# EAGLE schematic DriverSchematic (EAGLE 7.5.0)
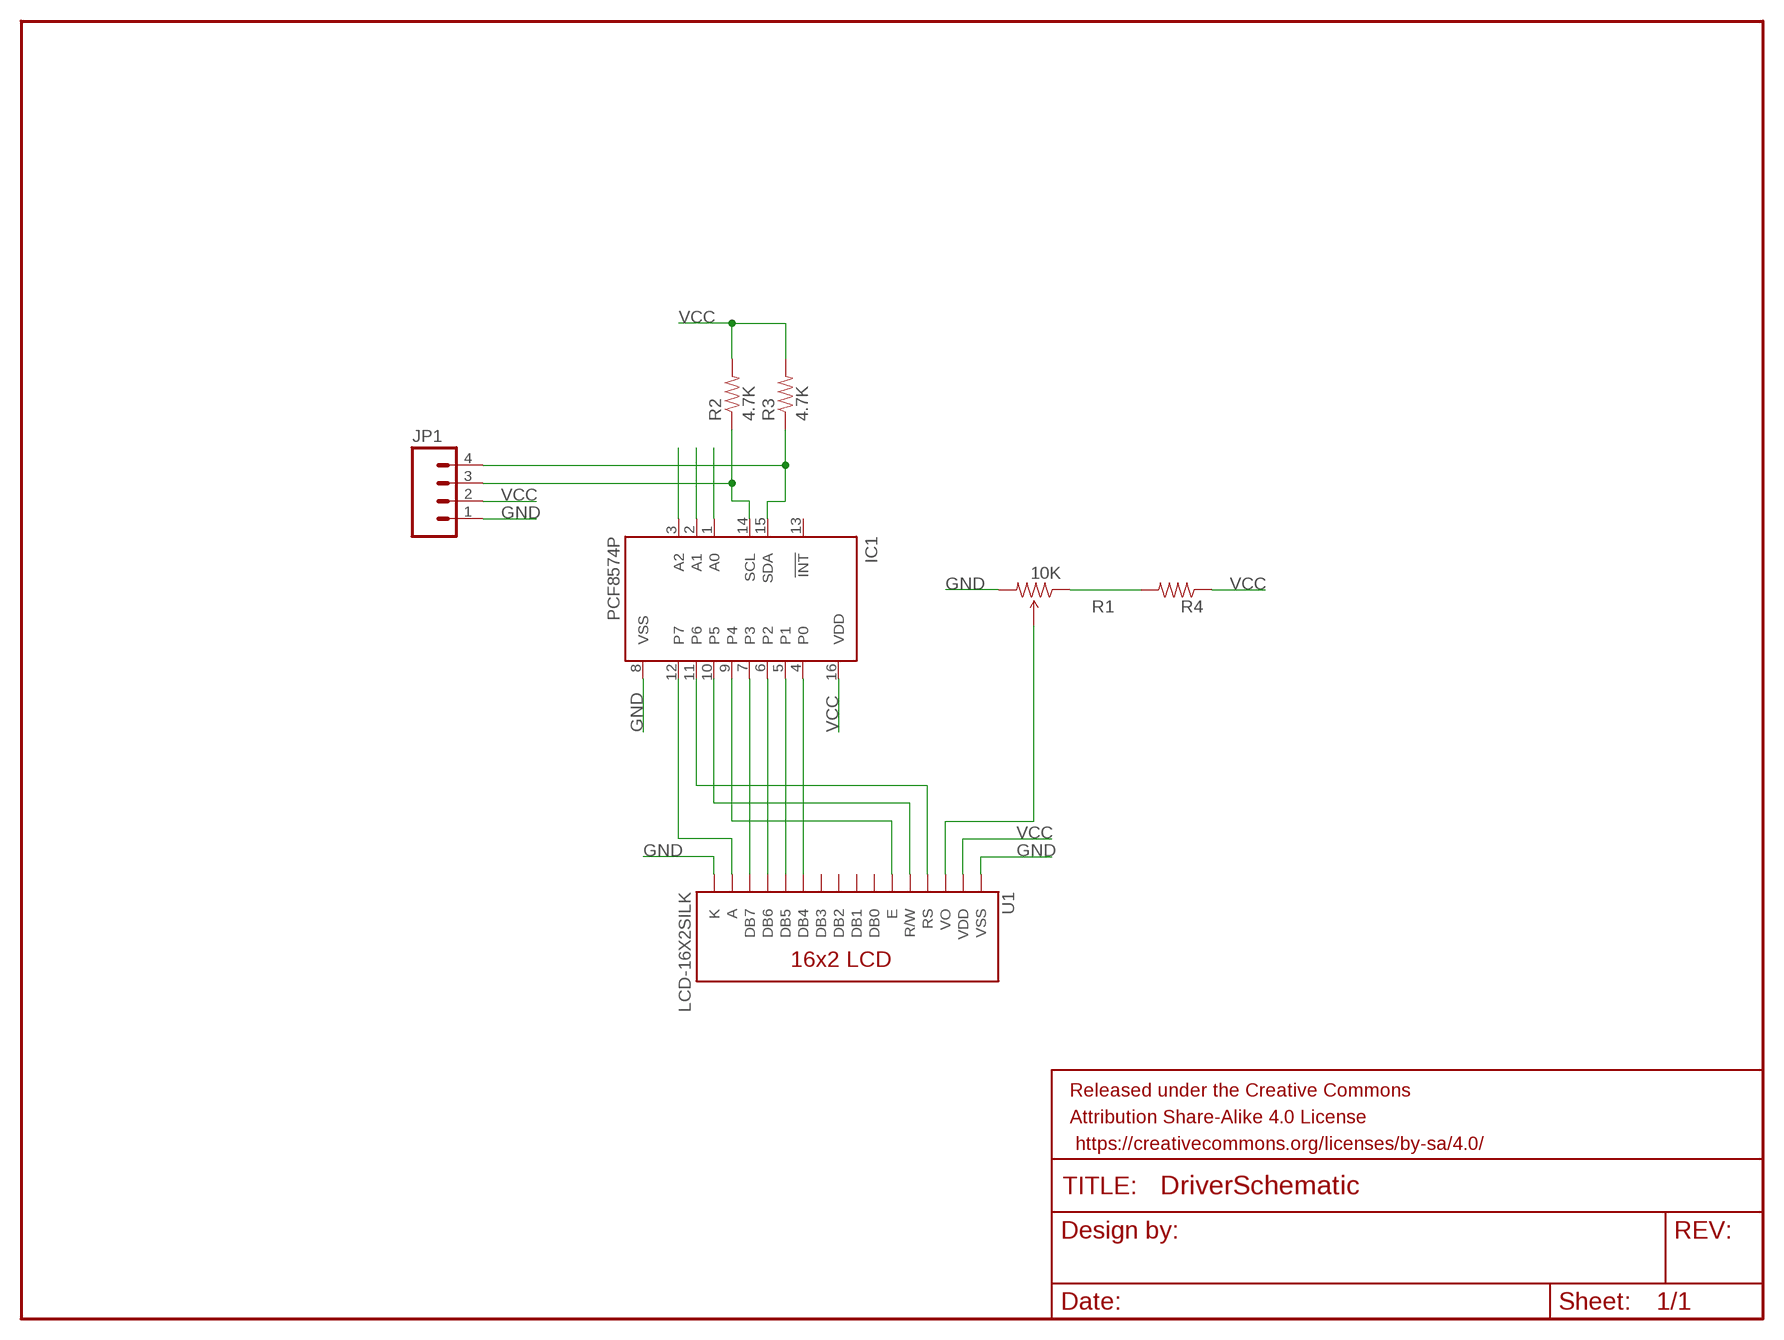
[diagram p0: schematic, sheet 1]

## Parts
FRAME1  FRAME-LETTER  [CREATIVE_COMMONS]
IC1  PCF8574P  [DIL16]
JP1  M04NO_SILK_ALL_ROUND  [1X04_NO_SILK_ALL_ROUND]
R1  10K  TRIMPOT-PTH-KNOB  [3386U]
R2  4.7K  RESISTOR1206  [1206]
R3  4.7K  RESISTOR1206  [1206]
R4  RESISTOR1206  [1206]
U1  LCD-16X2SILK  [LCD-16X2]

## Nets
GND: IC1.1(A0) IC1.2(A1) IC1.3(A2) IC1.8(VSS) JP1.1 R1.3(CW) U1.1(VSS) U1.16(K)
N$1: R1.2(WIPER) U1.3(VO)
N$2: R1.1(CCW) R4.2
N$3: IC1.15(SDA) JP1.4 R3.1
N$4: IC1.14(SCL) JP1.3 R2.1
N$11: IC1.12(P7) U1.15(A)
N$12: IC1.4(P0) U1.11(DB4)
N$13: IC1.5(P1) U1.12(DB5)
N$14: IC1.6(P2) U1.13(DB6)
N$15: IC1.7(P3) U1.14(DB7)
N$16: IC1.9(P4) U1.6(E)
N$17: IC1.10(P5) U1.5(R/W)
N$18: IC1.11(P6) U1.4(RS)
VCC: IC1.16(VDD) JP1.2 R2.2 R3.2 R4.1 U1.2(VDD)
Unconnected: IC1.13(!INT) U1.7(DB0) U1.8(DB1) U1.9(DB2) U1.10(DB3)

## Library data of the parts
FRAME1 = SparkFun-Aesthetics:FRAME-LETTER: Schematic Frame Standard 8.5x11 US Letter frame
IC1 = micro-philips:PCF8574: I2C-Bus Remote 8-bit I/O expander http://www.semiconductors.philips.com/acrobat_download/datasheets/PCF8574_4.pdf; MPN: PCF8574PN; OC_FARNELL: 204020; OC_NEWARK: 11N8515
JP1 = SparkFun-Connectors:M04: Header 4 Standard 4-pin 0.1" header. Use with straight break away headers (SKU : PRT-00116), right angle break away headers (PRT-00553), swiss pins (PRT-00743), machine pins (PRT-00117), and female headers (PRT-00115). Molex polarized connector foot print use with SKU : PRT-08231 with associated crimp pins and housings. 1MM SMD Version SKU: PRT-10208
R1 = SparkFun-Electromechanical:TRIMPOT: Various small potentiometers for "set-and-forget" applications; PROD_ID: RES-09730; VALUE: TSR-3386
R2-R4 = SparkFun-Passives:RESISTOR: Resistor Basic schematic elements and footprints for 0603, 1206, and PTH resistors.
U1 = SparkFun-Displays:LCD-16X2: Standard text-only 16x2 parallel input LCD